# Altium schematic sheet Indicator.SchDoc
size A4
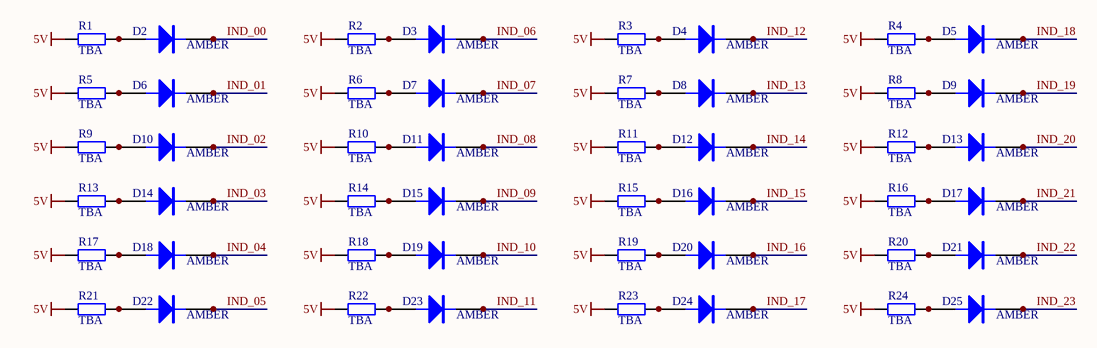
[diagram p0: Indicator.SchDoc]

## Parts
D2  AMBER  [CREE P4 YELLOW]
D3  AMBER  [CREE P4 YELLOW]
D4  AMBER  [CREE P4 YELLOW]
D5  AMBER  [CREE P4 YELLOW]
D6  AMBER  [CREE P4 YELLOW]
D7  AMBER  [CREE P4 YELLOW]
D8  AMBER  [CREE P4 YELLOW]
D9  AMBER  [CREE P4 YELLOW]
D10  AMBER  [CREE P4 YELLOW]
D11  AMBER  [CREE P4 YELLOW]
D12  AMBER  [CREE P4 YELLOW]
D13  AMBER  [CREE P4 YELLOW]
D14  AMBER  [CREE P4 YELLOW]
D15  AMBER  [CREE P4 YELLOW]
D16  AMBER  [CREE P4 YELLOW]
D17  AMBER  [CREE P4 YELLOW]
D18  AMBER  [CREE P4 YELLOW]
D19  AMBER  [CREE P4 YELLOW]
D20  AMBER  [CREE P4 YELLOW]
D21  AMBER  [CREE P4 YELLOW]
D22  AMBER  [CREE P4 YELLOW]
D23  AMBER  [CREE P4 YELLOW]
D24  AMBER  [CREE P4 YELLOW]
D25  AMBER  [CREE P4 YELLOW]
R1  TBA  [RESISTOR 0.400"]
R2  TBA  [RESISTOR 0.400"]
R3  TBA  [RESISTOR 0.400"]
R4  TBA  [RESISTOR 0.400"]
R5  TBA  [RESISTOR 0.400"]
R6  TBA  [RESISTOR 0.400"]
R7  TBA  [RESISTOR 0.400"]
R8  TBA  [RESISTOR 0.400"]
R9  TBA  [RESISTOR 0.400"]
R10  TBA  [RESISTOR 0.400"]
R11  TBA  [RESISTOR 0.400"]
R12  TBA  [RESISTOR 0.400"]
R13  TBA  [RESISTOR 0.400"]
R14  TBA  [RESISTOR 0.400"]
R15  TBA  [RESISTOR 0.400"]
R16  TBA  [RESISTOR 0.400"]
R17  TBA  [RESISTOR 0.400"]
R18  TBA  [RESISTOR 0.400"]
R19  TBA  [RESISTOR 0.400"]
R20  TBA  [RESISTOR 0.400"]
R21  TBA  [RESISTOR 0.400"]
R22  TBA  [RESISTOR 0.400"]
R23  TBA  [RESISTOR 0.400"]
R24  TBA  [RESISTOR 0.400"]

## Nets
5V: R1.2 R2.2 R3.2 R4.2 R5.2 R6.2 R7.2 R8.2 R9.2 R10.2 R11.2 R12.2 R13.2 R14.2 R15.2 R16.2 R17.2 R18.2 R19.2 R20.2 R21.2 R22.2 R23.2 R24.2
IND_00: D2.1(K) D2.4(K)
IND_01: D6.1(K) D6.4(K)
IND_02: D10.1(K) D10.4(K)
IND_03: D14.1(K) D14.4(K)
IND_04: D18.1(K) D18.4(K)
IND_05: D22.1(K) D22.4(K)
IND_06: D3.1(K) D3.4(K)
IND_07: D7.1(K) D7.4(K)
IND_08: D11.1(K) D11.4(K)
IND_09: D15.1(K) D15.4(K)
IND_10: D19.1(K) D19.4(K)
IND_11: D23.1(K) D23.4(K)
IND_12: D4.1(K) D4.4(K)
IND_13: D8.1(K) D8.4(K)
IND_14: D12.1(K) D12.4(K)
IND_15: D16.1(K) D16.4(K)
IND_16: D20.1(K) D20.4(K)
IND_17: D24.1(K) D24.4(K)
IND_18: D5.1(K) D5.4(K)
IND_19: D9.1(K) D9.4(K)
IND_20: D13.1(K) D13.4(K)
IND_21: D17.1(K) D17.4(K)
IND_22: D21.1(K) D21.4(K)
IND_23: D25.1(K) D25.4(K)
NetD2_2: D2.2(A) D2.3(A) R1.1
NetD3_2: D3.2(A) D3.3(A) R2.1
NetD4_2: D4.2(A) D4.3(A) R3.1
NetD5_2: D5.2(A) D5.3(A) R4.1
NetD6_2: D6.2(A) D6.3(A) R5.1
NetD7_2: D7.2(A) D7.3(A) R6.1
NetD8_2: D8.2(A) D8.3(A) R7.1
NetD9_2: D9.2(A) D9.3(A) R8.1
NetD10_2: D10.2(A) D10.3(A) R9.1
NetD11_2: D11.2(A) D11.3(A) R10.1
NetD12_2: D12.2(A) D12.3(A) R11.1
NetD13_2: D13.2(A) D13.3(A) R12.1
NetD14_2: D14.2(A) D14.3(A) R13.1
NetD15_2: D15.2(A) D15.3(A) R14.1
NetD16_2: D16.2(A) D16.3(A) R15.1
NetD17_2: D17.2(A) D17.3(A) R16.1
NetD18_2: D18.2(A) D18.3(A) R17.1
NetD19_2: D19.2(A) D19.3(A) R18.1
NetD20_2: D20.2(A) D20.3(A) R19.1
NetD21_2: D21.2(A) D21.3(A) R20.1
NetD22_2: D22.2(A) D22.3(A) R21.1
NetD23_2: D23.2(A) D23.3(A) R22.1
NetD24_2: D24.2(A) D24.3(A) R23.1
NetD25_2: D25.2(A) D25.3(A) R24.1

## Library data of the parts
D2-D25 = CP41B-AFSCM0Q0264: CREE AMBER LED P4 (SUPERFLUX)
R1-R24 = CMP-iaxfckaaxq3jb0c9euu5-1: RESISITOR THROUGH HOLE 1/4W; CustomComponentID: iaxfckaaxq3jb0c9euu5